# Altium schematic sheet ST_LINK_V2-1.SchDoc: ST_LINK_V2-1
size A3; Date: Not used; ApprovedBy: Not used; CheckedBy: Not used; Author: Not used; CompanyName: STMicroelectronics; DrawnBy: Not used; Engineer: Not used; Organization: Not used; Address1: Not used; Address2: Not used; Address3: Not used; Address4: Not used; DocumentNumber: 8; Revision: Not used; SheetNumber: 8; SheetTotal: 9; CurrentTime: Not used; CurrentDate: Not used; Time: Not used; DocumentFullPathAndName: Not used; DocumentName: Not used; ModifiedDate: Not used; ImagePath: Not used; ProjectName: Not used; Application_BuildNumber: Not used
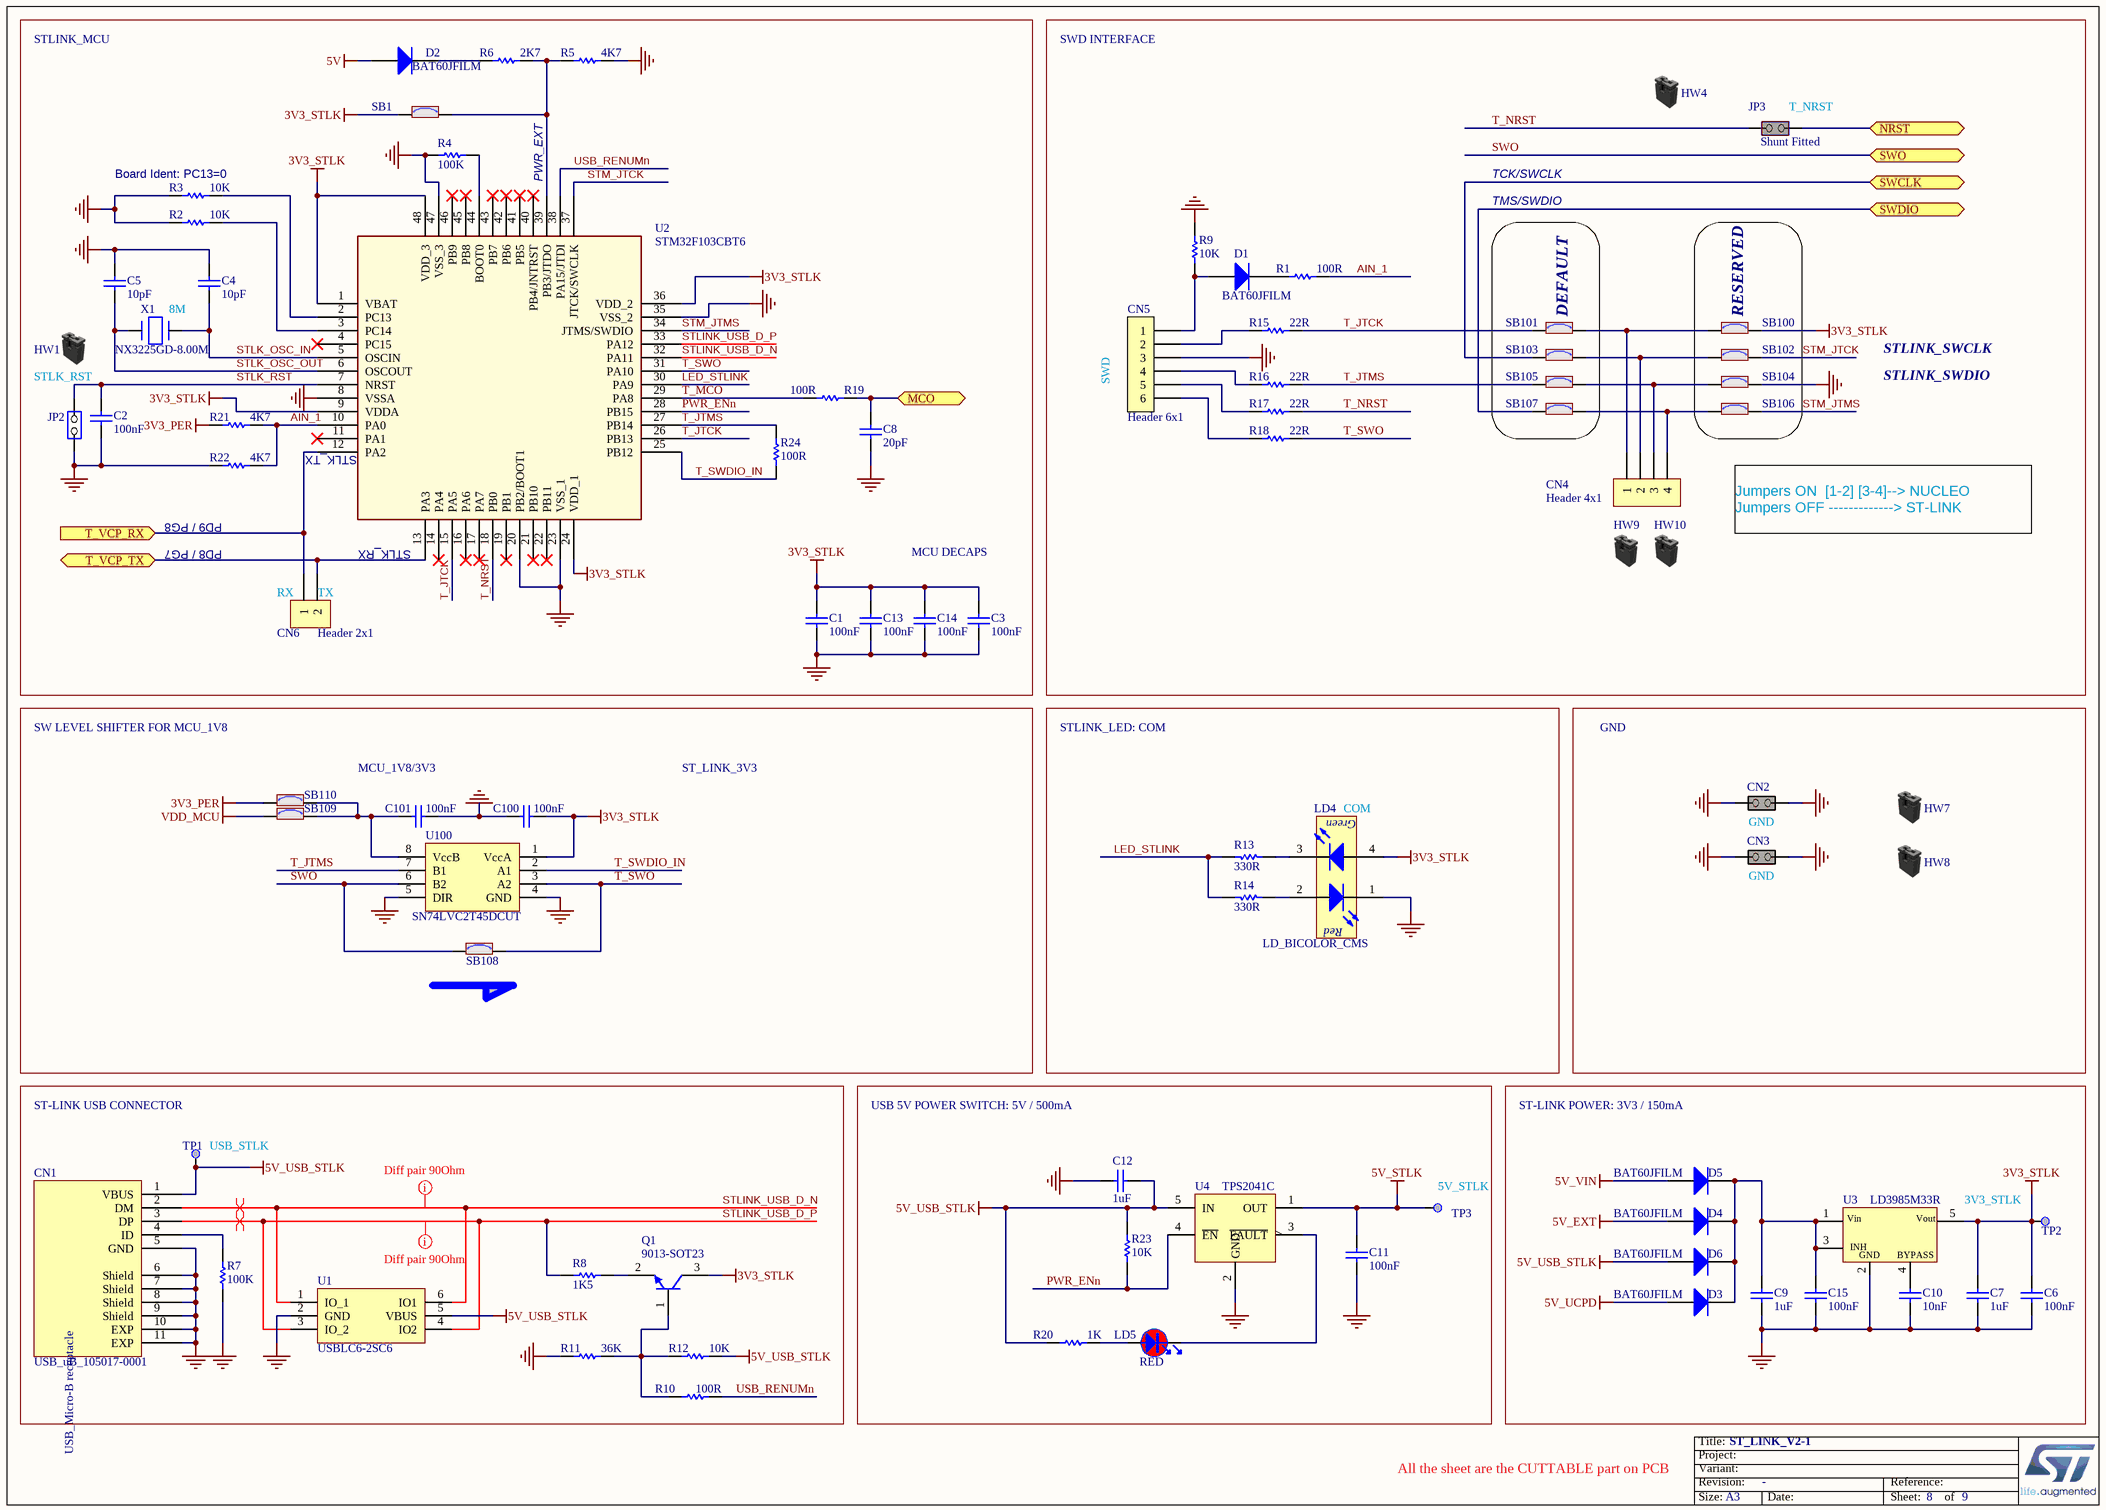
[diagram p0: ST_LINK_V2-1.SchDoc]

## Parts
C1  value 100nF  [C0603]
C2  value 100nF  [C0603]
C3  value 100nF  [C0603]
C4  value 10pF  [C0402]
C5  value 10pF  [C0402]
C6  value 100nF  [C0603]
C7  value 1uF  [C0603]  (hidden comment: Capacitor)
C8  value 20pF  [C0603]
C9  value 1uF  [C0603]
C10  value 10nF  [C0603]
C11  value 100nF  [C0603]
C12  value 1uF  [C0603]  (hidden comment: Capacitor)
C13  value 100nF  [C0603]
C14  value 100nF  [C0603]
C15  value 100nF  [C0603]
C100  value 100nF  [C0603]
C101  value 100nF  [C0603]
CN1  value USB_uB_105017-0001  [CON_USBMICROB_MOLEX_105017-0001_H2P90]
CN2  (no value)  [CON_SAMTEC_TSW-102-09-X-S]
CN3  (no value)  [CON_SAMTEC_TSW-102-09-X-S]
CN4  Header 4x1  [CON_SAMTEC_TSW-104-07-G-S]
CN5  value Header 6x1  [CON_SAMTEC_TSW-106-07-X-S]
CN6  value Header 2x1  [CON_SAMTEC_TSW-102-07-G-S]
D1  value BAT60JFILM  [DIO_SOD323]
D2  value BAT60JFILM  [DIO_SOD323]
D3  value BAT60JFILM  [DIO_SOD323]
D4  value BAT60JFILM  [DIO_SOD323]
D5  value BAT60JFILM  [DIO_SOD323]
D6  value BAT60JFILM  [DIO_SOD323]
HW1  (no value)  (mechanical)
HW4  (no value)  (mechanical)
HW7  (no value)  (mechanical)
HW8  (no value)  (mechanical)
HW9  (no value)  (mechanical)
HW10  (no value)  (mechanical)
JP2  (no value)  [CON_SAMTEC_TSW-102-07-G-S]
JP3  value Shunt Fitted  [CON_SAMTEC_TSW-102-07-G-S]
LD4  value LD_BICOLOR_CMS  [LED_BI-GR_HSMF-A201-A00J1]
LD5  value RED  [LED_0603_RED_H0P4]
Q1  value 9013-SOT23  [NPN_SOT23]
R1  value 100R  [R0603]
R2  value 10K  [R0603]
R3  value 10K  [R0603]
R4  value 100K  [R0603]
R5  value 4K7  [R0603]
R6  value 2K7  [R0603]
R7  value 100K  [R0603]
R8  value 1K5  [R0603]
R9  value 10K  [R0603]
R10  value 100R  [R0603]
R11  value 36K  [R0603]
R12  value 10K  [R0603]
R13  value 330R  [R0603]
R14  value 330R  [R0603]
R15  value 22R  [R0603]
R16  value 22R  [R0603]
R17  value 22R  [R0603]
R18  value 22R  [R0603]
R19  value 100R  [R0603]
R20  value 1K  [R0603]
R21  value 4K7  [R0603]
R22  value 4K7  [R0603]
R23  value 10K  [R0603]
R24  value 100R  [R0603]
SB1  (no value)  [SOLDER-BRIDGE_R0603-0R]
SB100  (no value)  [SOLDER-BRIDGE_R0603-0R]
SB101  (no value)  [SOLDER-BRIDGE_R0603-0R]
SB102  (no value)  [SOLDER-BRIDGE_R0603-0R]
SB103  (no value)  [SOLDER-BRIDGE_R0603-0R]
SB104  (no value)  [SOLDER-BRIDGE_R0603-0R]
SB105  (no value)  [SOLDER-BRIDGE_R0603-0R]
SB106  (no value)  [SOLDER-BRIDGE_R0603-0R]
SB107  (no value)  [SOLDER-BRIDGE_R0603-0R]
SB108  (no value)  [SOLDER-BRIDGE_R0603-0R]
SB109  (no value)  [SOLDER-BRIDGE_R0603-0R]
SB110  (no value)  [SOLDER-BRIDGE_R0603-0R]
TP1  (no value)  [TP_SMD_1MM]  (no BOM)
TP2  (no value)  [TP_SMD_1MM]  (no BOM)
TP3  (no value)  [TP_SMD_1MM]  (no BOM)
U1  value USBLC6-2SC6  [ESD_SOT23-6L]
U2  value STM32F103CBT6  [ICC_LQFP48_7X7_P050]
U3  value LD3985M33R  [REG_SOT23-5L]
U4  TPS2041C  [MOS_SOT23-5L]
U100  value SN74LVC2T45DCUT  [ICC_VSSOP8_DCU_R-PDSO-G8_2X2P30_P050]
X1  value NX3225GD-8.00M  [CRY_NX3225GD_2P]

## Blocks framed on the sheet
DEFAULT: SB101 SB103 SB105 SB107
RESERVED: SB100 SB102 SB104 SB106

## Ports
MCO, NRST, SWCLK, SWDIO, SWO, T_VCP_RX (in), T_VCP_TX

## Nets
3V3_PER: R21.1 SB110.2
3V3_STLK: C1.2 C3.2 C6.2 C7.2 C13.2 C14.2 C100.2 LD4.4(YellowGreen_anode) Q1.3(C) SB1.1 SB100.2 TP2.1 U2.1(VBAT) U2.9(VDDA) U2.24(VDD_1) U2.36(VDD_2) U2.48(VDD_3) U3.5(Vout) U100.1(VccA)
5V: D2.1(A)
5V_EXT: D4.1(A)
5V_STLK: C11.2 TP3.1 U4.1(OUT)
5V_UCPD: D3.1(A)
5V_USB_STLK: C12.2 CN1.1(VBUS) D6.1(A) R12.1 R20.1 R23.1 TP1.1 U1.5(VBUS) U4.5(IN)
5V_VIN: D5.1(A)
GND: C1.1 C2.1 C3.1 C4.2 C5.2 C6.1 C7.1 C8.2 C9.1 C10.1 C11.1 C12.1 C13.1 C14.1 C15.1 C100.1 C101.2 CN1.5(GND) CN1.6(Shield) CN1.7(Shield) CN1.8(Shield) CN1.9(Shield) CN1.10(EXP) CN1.11(EXP) CN2.1(COMMON) CN2.2(NO) CN3.1(COMMON) CN3.2(NO) CN5.3 JP2.1(COMMON) LD4.1(RED_cathode) R2.1 R3.1 R4.1 R5.2 R7.1 R9.2 R11.1 R22.1 SB104.2 U1.2(GND) U2.8(VSSA) U2.20(PB2/BOOT1) U2.23(VSS_1) U2.35(VSS_2) U2.47(VSS_3) U3.2(GND) U4.2(GND) U100.4(GND) U100.5(DIR)
VDD_MCU: SB109.2
AIN_1: R1.2 R21.2 R22.2 U2.10(PA0)
LED_STLINK: R13.2 R14.2 U2.30(PA9)
MCO: C8.1 R19.2 ; port MCO
NRST: JP3.2(NO) ; port NRST
PWR_ENn: R23.2 U2.28(PB15) U4.4(~{EN})
STLINK_USB_D_N: CN1.2(DM) U1.1(IO_1) U1.6(IO1) U2.32(PA11)
STLINK_USB_D_P: CN1.3(DP) R8.2 U1.3(IO_2) U1.4(IO2) U2.33(PA12)
STLK_OSC_IN: C4.1 U2.5(OSCIN) X1.1(X1)
STLK_OSC_OUT: C5.1 U2.6(OSCOUT) X1.2(X2)
STLK_RST: C2.2 JP2.2(NO) U2.7(NRST)
STM_JTCK: SB102.2 U2.37(JTCK/SWCLK)
STM_JTMS: SB106.2 U2.34(JTMS/SWDIO)
SWCLK: SB103.1 ; port SWCLK
SWDIO: SB107.1 ; port SWDIO
SWO: SB108.2 U100.6(B2) ; port SWO
T_JTCK: R15.2 SB101.1 U2.15(PA5) U2.26(PB13)
T_JTMS: R16.2 R24.2 SB105.1 U2.27(PB14) U100.7(B1)
T_MCO: R19.1 U2.29(PA8)
T_NRST: JP3.1(COMMON) R17.2 U2.18(PB0)
T_SWDIO_IN: R24.1 U2.25(PB12) U100.2(A1)
T_SWO: R18.2 SB108.1 U2.31(PA10) U100.3(A2)
T_VCP_RX: CN6.1 U2.12(PA2) ; port T_VCP_RX
T_VCP_TX: CN6.2 U2.13(PA3) ; port T_VCP_TX
USB_RENUMn: R10.2 U2.38(PA15/JTDI)
NetC9_2: C9.2 C15.2 D3.2(K) D4.2(K) D5.2(K) D6.2(K) U3.1(Vin) U3.3(CE)
NetC10_2: C10.2 U3.4(BYPASS)
NetC101_1: C101.1 SB109.1 SB110.1 U100.8(VccB)
NetCN1_4: CN1.4(ID) R7.2
NetCN4_1: CN4.1 SB100.1 SB101.2
NetCN4_2: CN4.2 SB102.1 SB103.2
NetCN4_3: CN4.3 SB104.1 SB105.2
NetCN4_4: CN4.4 SB106.1 SB107.2
NetCN5_1: CN5.1 D1.1(A) R9.1
NetCN5_2: CN5.2 R15.1
NetCN5_4: CN5.4 R16.1
NetCN5_5: CN5.5 R17.1
NetCN5_6: CN5.6 R18.1
NetD1_2: D1.2(K) R1.1
NetD2_2: D2.2(K) R6.1
NetLD4_2: LD4.2(Red_anode) R14.1
NetLD4_3: LD4.3(YellowGreen_cathode) R13.1
NetLD5_1: LD5.1 R20.2
NetLD5_2: LD5.2 U4.3(~{FAULT})
NetQ1_1: Q1.1(B) R10.1 R11.2 R12.2
NetQ1_2: Q1.2(E) R8.1
NetR2_2: R2.2 U2.3(PC14)
NetR3_2: R3.2 U2.2(PC13)
NetR4_2: R4.2 U2.44(BOOT0)
NetR5_1: R5.1 R6.2 SB1.2 U2.39(PB3/JTDO)

Not connected (* = marked no-connect by the designer): U2 4(PC15)* 11(PA1)* 14(PA4)* 16(PA6)* 17(PA7)* 19(PB1)* 21(PB10)* 22(PB11)* 40(PB4/JNTRST)* 41(PB5)* 42(PB6)* 43(PB7)* 45(PB8)* 46(PB9)*

## Layout directives
mark named Diff pair 90Ohm: STLINK_USB_D_N, STLINK_USB_D_P
differential pair: STLINK_USB_D_N, STLINK_USB_D_P

## Notes on the sheet
- STLINK_MCU
- SWD INTERFACE
- (near JP3) T_NRST
- (near R3) Board Ident: PC13=0
- PWR_EXT
- TCK/SWCLK
- TMS/SWDIO
- (near X1) 8M
- STLK_RST
- (near CN5) SWD
- STLINK_SWCLK
- STLINK_SWDIO
- (near U2) STLK_TX
- PD9 / PG8
- PD8 / PG7
- (near U2) STLK_RX
- MCU DECAPS
- Jumpers ON  [1-2] [3-4]--> NUCLEO
  Jumpers OFF -------------> ST-LINK
- (near CN6) RX
- (near CN6) TX
- SW LEVEL SHIFTER FOR MCU_1V8
- MCU_1V8/3V3
- ST_LINK_3V3
- STLINK_LED: COM
- GND
- (near LD4) COM
- (near CN2) GND
- (near CN3) GND
- ST-LINK USB CONNECTOR
- USB 5V POWER SWITCH: 5V / 500mA
- ST-LINK POWER: 3V3 / 150mA
- (near TP1) USB_STLK
- (near TP3) 5V_STLK
- 3V3_STLK
- All the sheet are the CUTTABLE part on PCB
- Title:
- Project:
- Size:
- Revision:
- Variant:
- A3
- -
- Date:
- Reference:
- Sheet:
- of
- (in symbol MCD-00028) USB_Micro-B receptacle
- (in symbol MCD-00051) Green; Red
- (in symbol MCD-00086) INH

## Library data of the parts
C1-C3 C6 C11 C13-C15 C100 C101 = MCD-00211: Capacitor, MLCC, 100nF, 16V, X7R, 10%, 0603, T=0,8mm; Manufacturer_Part_Number: CC0603KRX7R7BB104; Manufacturer: YAGEO; Provided_By: Subcon; Initial_Board_Reference: MB1319; Internal_Part_Number: MCD-00211; ECCN_US: n/a; ECCN_EU: n/a; ComponentLink1Description: Datasheet; Status: Released; Part_Type: Capacitor; Package: C0603; ComponentLink1URL: http://tunmcdsvn.tun.st.com/Component_Datasheet_Library/Trunk/Capacitors/Yageo_Multilayer_Capacitor_X7R_series_100pF_to_22uF
C4 C5 = MCD-00015: Capacitor, MLCC, 10pF, 50V, NPO, 5%, 0402, T=0,5mm; Manufacturer_Part_Number: CC0402JRNPO9BN100; Manufacturer: YAGEO; Provided_By: subcon; Initial_Board_Reference: MB1274; Internal_Part_Number: MCD-00015; ECCN_US: n/a; ECCN_EU: n/a; ComponentLink1Description: Datasheet; Status: Released; Part_Type: Capacitor; Package: C0402; ComponentLink1URL: http://tunmcdsvn.tun.st.com/Component_Datasheet_Library/Trunk/Capacitors/Yageo_Capacitor_NP0_16V-to-50V
C7 C12 = MCD-00010: Capacitor, MLCC, 1uF, 16V, X5R, 10%, 0603, T=0,8mm; Manufacturer_Part_Number: CC0603KRX5R7BB105; Manufacturer: YAGEO; Provided_By: SUBCO; Internal_Part_Number: MCD-00010; Status: Released; Part_Type: Capacitor; Package: C0603; ComponentLink1Description: Datasheet; ComponentLink1URL: http://tunmcdsvn.tun.st.com/Component_Datasheet_Library/Trunk/Capacitors/Yageo_Multilayer_capacitor_X5R_series_100pF_to_100uF
C8 = MCD-00638: Capacitor, MLCC, 20pF, 50V, NPO, 5%, 0603, T=0,8mm; Manufacturer_Part_Number: CC0603JRNPO9BN200; Manufacturer: YAGEO; Provided_By: Subcon; Initial_Board_Reference: MB1319; Internal_Part_Number: MCD-00638; Status: Released; Part_Type: Capacitor; Package: C0603; ComponentLink1Description: Datasheet; ECCN_US: n/a; ECCN_EU: n/a; ComponentLink1URL: http://tunmcdsvn.tun.st.com/Component_Datasheet_Library/Trunk/Capacitors/Yageo_Capacitor_NP0_16V-to-50V
C9 = MCD-00010: Capacitor, MLCC, 1uF, 16V, X5R, 10%, 0603, T=0,8mm; Manufacturer_Part_Number: CC0603KRX5R7BB105; Manufacturer: YAGEO; Provided_By: Subcon; Initial_Board_Reference: MB1274; Internal_Part_Number: MCD-00010; ECCN_US: n/a; ECCN_EU: n/a; ComponentLink1Description: Datasheet; Status: Released; Part_Type: Capacitor; Package: C0603; ComponentLink1URL: http://tunmcdsvn.tun.st.com/Component_Datasheet_Library/Trunk/Capacitors/Yageo_Multilayer_capacitor_X5R_series_100pF_to_100uF
C10 = MCD-00017: Capacitor, MLCC, 10nF, 50V, X7R, 10%, 0603, T=0.8mm; Manufacturer_Part_Number: CC0603KRX7R9BB103; Manufacturer: YAGEO; Provided_By: Subcon; Initial_Board_Reference: MB1274; Internal_Part_Number: MCD-00017; ECCN_US: n/a; ECCN_EU: n/a; ComponentLink1Description: Datasheet; Status: Released; Part_Type: Capacitor; Package: C0603; ComponentLink1URL: http://tunmcdsvn.tun.st.com/Component_Datasheet_Library/Trunk/Capacitors/Yageo_Multilayer_Capacitor_X7R_series_100pF_to_22uF
CN1 = MCD-00028: USB-MICRO-B, 0.65mm, RA, SMT, Bottom Mount,; Manufacturer_Part_Number: 1050170001; Manufacturer: MOLEX; Part_Type: Connector; Provided_By: Subcon; Initial_Board_Reference: MB1274; Internal_Part_Number: MCD-00028; ECCN_US: n/a; ECCN_EU: n/a; ComponentLink1Description: Datasheet; Status: Released; ComponentLink1URL: http://tunmcdsvn.tun.st.com/Component_Datasheet_Library/Trunk/Connectors/Molex_Connector-USB-microB_105017-0001
CN2 CN3 = MCD-00214: Header, 2x1, 2,54mm, VR, TH, Height 5.84mm/10.16mm; Manufacturer_Part_Number: TSW-102-09-x-S; Manufacturer: SAMTEC; Part_Type: Connector; Value: Header 2x1 16mm; Provided_By: Subcon; Initial_Board_Reference: MB1319; Internal_Part_Number: MCD-00214; ECCN_US: n/a; ECCN_EU: n/a; ComponentLink1Description: Datasheet; Status: Released; ComponentLink1URL: http://tunmcdsvn.tun.st.com/Component_Datasheet_Library/Trunk/Connectors/Samtec_TSW-HTSW-series
CN4 = MCD-00029: Header, 4x1, 2,54mm, VR, TH, Height 5.84mm/2.54mm; Part_Type: Connector; Manufacturer_Part_Number: TSW-104-07-x-S; Manufacturer: SAMTEC; Provided_By: SUBCO; Initial_Board_Reference: MB1274; Path: ws/MCD_ApplicationBoards/Lists/MCDPARTSdatabase; Item Type: Item; Internal_Part_Number: MCD-00029; Value: Header 4x1; Status: Released; ComponentLink1Description: Datasheet; ComponentLink1URL: http://tunmcdsvn.tun.st.com/Component_Datasheet_Library/Trunk/Connectors/Samtec_TSW-HTSW-series
CN5 = MCD-00212: Header, 6x1, 2,54mm, VR, TH, Height 5.84mm/2.54mm; Manufacturer_Part_Number: TSW-106-07-x-S; Manufacturer: SAMTEC; Part_Type: Connector; Provided_By: Subcon; Initial_Board_Reference: MB1319; Internal_Part_Number: MCD-00212; ECCN_US: n/a; ECCN_EU: n/a; ComponentLink1Description: Datasheet; Status: Released; ComponentLink1URL: http://tunmcdsvn.tun.st.com/Component_Datasheet_Library/Trunk/Connectors/Samtec_TSW-HTSW-series
CN6 = MCD-00032: Header, 2x1, 2,54mm, VR, TH, Height 5.84mm/2.54mm; Manufacturer_Part_Number: TSW-102-07-x-S; Manufacturer: SAMTEC; Part_Type: Connector; Provided_By: Subcon; Initial_Board_Reference: MB1274; Internal_Part_Number: MCD-00032; ECCN_US: n/a; ECCN_EU: n/a; ComponentLink1Description: Datasheet; Status: Released; ComponentLink1URL: http://tunmcdsvn.tun.st.com/Component_Datasheet_Library/Trunk/Connectors/Samtec_TSW-HTSW-series
D1-D6 = MCD-00034: BAT60JFILM; Manufacturer: STMICROELECTRONICS; Part_Type: Diode; ECCN_US: EAR99; ECCN_EU: NEC; Provided_By: Subcon; Initial_Board_Reference: MB1274; Internal_Part_Number: MCD-00034; Manufacturer_Part_Number: BAT60JFILM; ComponentLink1Description: Datasheet; Status: Released; ComponentLink1URL: http://tunmcdsvn.tun.st.com/Component_Datasheet_Library/Trunk/Diodes/STM_Diode_BAT60JFILM-SOD323
HW1 HW4 HW7-HW10 = MCD-00043: SHUNT 2.54mm BLACK; Manufacturer_Part_Number: SNT-100-BK-G; Manufacturer: SAMTEC; Part_Type: Mechanical; Provided_By: Subcon; Initial_Board_Reference: MB1274; Internal_Part_Number: MCD-00043; ECCN_US: n/a; ECCN_EU: n/a; ComponentLink1Description: Datasheet; Status: Released; ComponentLink1URL: http://tunmcdsvn.tun.st.com/Component_Datasheet_Library/Trunk/Connectors/Samtec_Shunt_Jumper_SNT100
JP2 = MCD-00045: Header, 2x1, 2,54mm, VR, TH, Height 5.84mm/2.54mm; Manufacturer_Part_Number: TSW-102-07-x-S; Manufacturer: SAMTEC; Part_Type: Connector; Value: Shunt not fitted; Provided_By: Subcon; Initial_Board_Reference: MB1274; Remark: 3D KO: BZ: 40098; Internal_Part_Number: MCD-00045; ECCN_US: n/a; ECCN_EU: n/a; ComponentLink1Description: Datasheet; Status: Footprint available; ComponentLink1URL: http://tunmcdsvn.tun.st.com/Component_Datasheet_Library/Trunk/Connectors/Samtec_TSW-HTSW-series
JP3 = MCD-00683: Header, 2x1, 2,54mm, VR, TH, Height 5.84mm/2.54mm - Shunt Fitted by default; Part_Type: Connector; Manufacturer_Part_Number: TSW-102-07-x-S; Manufacturer: SAMTEC; Provided_By: Subcon; Initial_Board_Reference: MB1331; Internal_Part_Number: MCD-00683; Status: Released; ComponentLink1Description: Datasheet; ComponentLink1URL: http://tunmcdsvn.tun.st.com/Component_Datasheet_Library/Trunk/Connectors/Samtec_TSW-HTSW-series; ECCN_US: n/a; ECCN_EU: n/a; Remark: Shunt Fitted
LD4 = MCD-00051: LED Bicolor; Manufacturer_Part_Number: HSMF-A201-A00J1; Manufacturer: AVAGO TECHNOLOGIES; Alternate_Manufacturer_Part_Number: LE-RGW35280; Alternate_Manufacturer: EVERLUCK; Part_Type: Display; ECCN_US: EAR99; ECCN_EU: NEC; Provided_By: Subcon; Initial_Board_Reference: MB1274; Internal_Part_Number: MCD-00051; ComponentLink1Description: Datasheet; Status: Released; ComponentLink1URL: http://tunmcdsvn.tun.st.com/Component_Datasheet_Library/Trunk/Display/Avago_LED-SMC_HSMx-A2xx-02Feb2012
LD5 = MCD-00322: LED, Red, 0603; Part_Type: Display; Manufacturer_Part_Number: 19-217/R6C-AL1M2VY/3T; Manufacturer: EVERLIGHT; ECCN_US: EAR99; ECCN_EU: NEC; Provided_By: Subcon; Initial_Board_Reference: MB1311; Internal_Part_Number: MCD-00322; Status: Released; Package: LED 0603; ComponentLink1Description: Datasheet; ComponentLink1URL: http://tunmcdsvn.tun.st.com/Component_Datasheet_Library/Trunk/Display/Everlight_SMD-LED-RED_19-213-R6C-AP1Q2B-3T-V3.doc
Q1 = MCD-00073: NPN Bipolar Transistor; Manufacturer_Part_Number: BSR14; Manufacturer: NXP; Part_Type: IC; ECCN_US: EAR99; ECCN_EU: NEC; Provided_By: Subcon; Initial_Board_Reference: MB1274; Revision: *; Internal_Part_Number: MCD-00073; ComponentLink1Description: Datasheet; Status: Released; ComponentLink1URL: http://tunmcdsvn.tun.st.com/Component_Datasheet_Library/Trunk/IC/NXP_Transistor_BSR14
R1 R10 R19 R24 = MCD-00224: Resistor,100R,0603,1%,1/10W; Manufacturer_Part_Number: RC0603FR-07100RL; Manufacturer: YAGEO; Provided_By: Subcon; Initial_Board_Reference: MB1319; Internal_Part_Number: MCD-00224; ECCN_US: n/a; ECCN_EU: n/a; ComponentLink1Description: Datasheet; Status: Released; Part_Type: Resistor; Package: R0603; ComponentLink1URL: http://tunmcdsvn.tun.st.com/Component_Datasheet_Library/Trunk/Resistors/Yageo_Resistor_RC0603-series
R2 R3 R9 R12 R23 = MCD-00220: Resistor,10K,0603,1%,1/10W; Manufacturer_Part_Number: RC0603FR-0710KL; Manufacturer: YAGEO; Provided_By: Subcon; Initial_Board_Reference: MB1319; Internal_Part_Number: MCD-00220; ECCN_US: n/a; ECCN_EU: n/a; ComponentLink1Description: Datasheet; Status: Released; Part_Type: Resistor; Package: R0603; ComponentLink1URL: http://tunmcdsvn.tun.st.com/Component_Datasheet_Library/Trunk/Resistors/Yageo_Resistor_RC0603-series
R4 R7 = MCD-00223: Resistor,100K,0603,1%,1/10W; Manufacturer_Part_Number: RC0603FR-07100KL; Manufacturer: YAGEO; Provided_By: Subcon; Initial_Board_Reference: MB1319; Internal_Part_Number: MCD-00223; ECCN_US: n/a; ECCN_EU: n/a; ComponentLink1Description: Datasheet; Status: Released; Part_Type: Resistor; Package: R0603; ComponentLink1URL: http://tunmcdsvn.tun.st.com/Component_Datasheet_Library/Trunk/Resistors/Yageo_Resistor_RC0603-series
R5 R21 R22 = MCD-00219: Resistor,4K7,0603,1%,1/10W; Manufacturer_Part_Number: RC0603FR-074K7L; Manufacturer: YAGEO; Provided_By: Subcon; Initial_Board_Reference: MB1319; Internal_Part_Number: MCD-00219; ECCN_US: n/a; ECCN_EU: n/a; ComponentLink1Description: Datasheet; Status: Released; Part_Type: Resistor; Package: R0603; ComponentLink1URL: http://tunmcdsvn.tun.st.com/Component_Datasheet_Library/Trunk/Resistors/Yageo_Resistor_RC0603-series
R6 = MCD-00218: Resistor,2K7,0603,1%,1/10W; Manufacturer_Part_Number: RC0603FR-072K7L; Manufacturer: YAGEO; Provided_By: Subcon; Initial_Board_Reference: MB1319; Internal_Part_Number: MCD-00218; ECCN_US: n/a; ECCN_EU: n/a; ComponentLink1Description: Datasheet; Status: Released; Part_Type: Resistor; Package: R0603; ComponentLink1URL: http://tunmcdsvn.tun.st.com/Component_Datasheet_Library/Trunk/Resistors/Yageo_Resistor_RC0603-series
R8 = MCD-00217: Resistor,1K5,0603,1%,1/10W; Manufacturer_Part_Number: RC0603FR-071K5L; Manufacturer: YAGEO; Provided_By: Subcon; Initial_Board_Reference: MB1319; Internal_Part_Number: MCD-00217; ECCN_US: n/a; ECCN_EU: n/a; ComponentLink1Description: Datasheet; Status: Released; Part_Type: Resistor; Package: R0603; ComponentLink1URL: http://tunmcdsvn.tun.st.com/Component_Datasheet_Library/Trunk/Resistors/Yageo_Resistor_RC0603-series
R11 = MCD-00221: Resistor,36K,0603,1%,1/10W; Manufacturer_Part_Number: RC0603FR-0736KL; Manufacturer: YAGEO; Provided_By: Subcon; Initial_Board_Reference: MB1319; Internal_Part_Number: MCD-00221; ECCN_US: n/a; ECCN_EU: n/a; ComponentLink1Description: Datasheet; Status: Released; Part_Type: Resistor; Package: R0603; ComponentLink1URL: http://tunmcdsvn.tun.st.com/Component_Datasheet_Library/Trunk/Resistors/Yageo_Resistor_RC0603-series
R13 R14 = MCD-00197: Resistor,330R,0603,1%,1/10W; Manufacturer_Part_Number: RC0603FR-07330RL; Manufacturer: YAGEO; Provided_By: Subcon; Internal_Part_Number: MCD-00197; ComponentLink1Description: Datasheet; ECCN_US: n/a; ECCN_EU: n/a; Status: Released; Part_Type: Resistor; Package: R0603; ComponentLink1URL: http://tunmcdsvn.tun.st.com/Component_Datasheet_Library/Trunk/Resistors/Yageo_Resistor_RC0603-series
R15-R18 = MCD-00190: Resistor,22R,0603,1%,1/10W; Manufacturer_Part_Number: RC0603FR-0722RL; Manufacturer: YAGEO; Provided_By: Subcon; Internal_Part_Number: MCD-00190; ComponentLink1Description: Datasheet; ECCN_US: n/a; ECCN_EU: n/a; Status: Released; Part_Type: Resistor; Package: R0603; ComponentLink1URL: http://tunmcdsvn.tun.st.com/Component_Datasheet_Library/Trunk/Resistors/Yageo_Resistor_RC0603-series
R20 = MCD-00070: Resistor,1K,0603,1%,1/10W; Manufacturer_Part_Number: RC0603FR-071KL; Manufacturer: YAGEO; Provided_By: Subcon; Initial_Board_Reference: MB1274; Internal_Part_Number: MCD-00070; ECCN_US: n/a; ECCN_EU: n/a; ComponentLink1Description: Datasheet; Status: Released; Part_Type: Resistor; Package: R0603; ComponentLink1URL: http://tunmcdsvn.tun.st.com/Component_Datasheet_Library/Trunk/Resistors/Yageo_Resistor_RC0603-series
SB1 SB100-SB110 = MCD-00071: Solder Bridge ON; Part_Type: Mechanical; Provided_By: Subcon; Initial_Board_Reference: MB1274; Internal_Part_Number: MCD-00071; ECCN_US: n/a; ECCN_EU: n/a; Status: Released; ComponentLink1Description: Datasheet
TP1-TP3 = MCD-00074: Test Point 1mm; Part_Type: Mechanical; Initial_Board_Reference: MB1274; Internal_Part_Number: MCD-00074; Value: 1mm; Status: Released; Manufacturer_Part_Number: n/a; Manufacturer: n/a; ComponentLink1Description: Datasheet; ComponentLink1URL: http://na; ECCN_US: n/a; ECCN_EU: n/a; Provided_By: n/a
U1 = MCD-00163: Very low capacitance ESD protection; Part_Type: IC; Manufacturer: STMICROELECTRONICS; ECCN_US: EAR99; ECCN_EU: NEC; Provided_By: Subcon; Initial_Board_Reference: MB1263; Internal_Part_Number: MCD-00163; Status: Released; Manufacturer_Part_Number: USBLC6-2SC6; ComponentLink1Description: Datasheet; ComponentLink1URL: http://tunmcdsvn.tun.st.com/Component_Datasheet_Library/Trunk/Diodes/STM_ESD_USBLC6-2
U2 = MCD-00085: Medium-density performance line ARM-based 32-bit MCU with 128KB Flash; Manufacturer: STMICROELECTRONICS; Part_Type: IC; ECCN_US: 3A991A2; ECCN_EU: NEC; Provided_By: Subcon; Initial_Board_Reference: MB1274; Internal_Part_Number: MCD-00085; Manufacturer_Part_Number: STM32F103CBT6; ComponentLink1Description: Datasheet; Status: Released; ComponentLink1URL: http://tunmcdsvn.tun.st.com/Component_Datasheet_Library/Trunk/IC/STM_STM32F103CBT6
U3 = MCD-00086: Ultra low drop-low noise BiCMOS voltage, regulators low ESR capacitors compatible; Manufacturer: STMICROELECTRONICS; Part_Type: IC; ECCN_US: EAR99; ECCN_EU: NEC; Provided_By: Subcon; Initial_Board_Reference: MB1274; Internal_Part_Number: MCD-00086; Manufacturer_Part_Number: LD3985M33R; ComponentLink1Description: Datasheet; Status: Released; ComponentLink1URL: http://tunmcdsvn.tun.st.com/Component_Datasheet_Library/Trunk/IC/STM_LDO_LD3985
U4 = MCD-01785: 5V Power Switch, 0.85A, RDSon 130mOhm max, with active low enable pin; Part_Type: IC; Manufacturer_Part_Number: TPS2041CDBVT; Manufacturer: TEXAS INSTRUMENTS; ECCN_US: EAR99; ECCN_EU: NEC; Provided_By: SUBCO; Internal_Part_Number: MCD-01785; Value: TPS2041C; Status: Footprint available; Package: SOT23_5p; ComponentLink1Description: Datasheet; ComponentLink1URL: http://tunmcdsvn.tun.st.com/Component_Datasheet_Library/Trunk/IC/TI_PWR_SWITCH_5V_TPS20xxC
U100 = MCD-00264: Dual bit dual supply bus transceiver; Part_Type: IC; Manufacturer: TEXAS INSTRUMENTS; ECCN_US: EAR99; ECCN_EU: NEC; Provided_By: Subcon; Initial_Board_Reference: MB1319; Internal_Part_Number: MCD-00264; Status: Released; Manufacturer_Part_Number: SN74LVC2T45DCUT; ComponentLink1Description: Datasheet; ComponentLink1URL: http://tunmcdsvn.tun.st.com/Component_Datasheet_Library/Trunk/IC/TI_Dual_bit_tranceiver_SN74LVC2T45
X1 = MCD-00092: Crystal 8Mhz, 8pF, -+50PPM, SMD; Manufacturer_Part_Number: NX3225GD 8MHz EXS00A-CG04874; Manufacturer: NDK; Part_Type: Crystal_Osc; ECCN_US: EAR99; ECCN_EU: NEC; Provided_By: STM; Initial_Board_Reference: MB1274; Internal_Part_Number: MCD-00092; ComponentLink1Description: Datasheet; Status: Released; ComponentLink1URL: http://tunmcdsvn.tun.st.com/Component_Datasheet_Library/Trunk/Crystal_Osc/NDK_Crystal-For-ST_NX3225GD 8MHz EXS00A-CG04874 (EXS10B-20725)